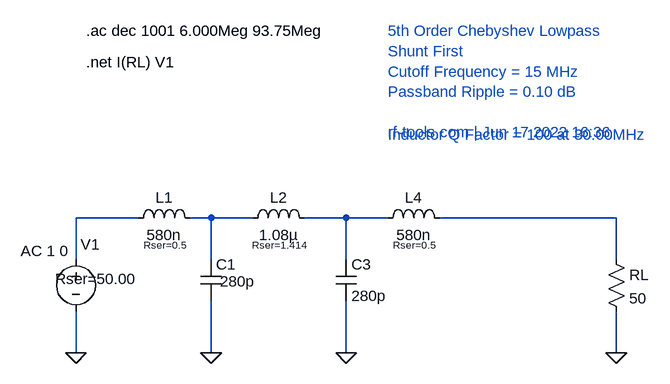
[diagram p0: schematic 14M.asc]
14M.asc, the LTspice schematic file:
Version 4
SHEET 1 1200 400
WIRE 96 0 0 0
WIRE 208 0 176 0
WIRE 272 0 208 0
WIRE 416 0 352 0
WIRE 480 0 416 0
WIRE 832 0 560 0
WIRE 0 64 0 0
WIRE 208 64 208 0
WIRE 416 64 416 0
WIRE 832 64 832 0
WIRE 0 208 0 144
WIRE 208 208 208 128
WIRE 416 208 416 128
WIRE 832 208 832 144
FLAG 0 208 0
FLAG 208 208 0
FLAG 416 208 0
FLAG 832 208 0
SYMBOL voltage 0 48 R0
WINDOW 123 -85 3 Left 2
WINDOW 39 -32 46 Left 2
WINDOW 0 7 -7 Left 2
SYMATTR Value2 AC 1 0
SYMATTR SpiceLine Rser=50.00
SYMATTR InstName V1
SYMATTR Value ""
SYMBOL cap 192 64 R0
WINDOW 3 30 34 Left 2
SYMATTR Value 280p
SYMATTR InstName C1
SYMBOL ind 256 16 R270
WINDOW 0 32 56 VTop 2
WINDOW 3 5 56 VBottom 2
WINDOW 39 -36 57 VTop 1
SYMATTR InstName L2
SYMATTR Value 1.08µ
SYMATTR SpiceLine Rser=1.414
SYMBOL cap 400 64 R0
SYMATTR InstName C3
SYMATTR Value 280p
SYMBOL ind 464 16 R270
WINDOW 0 32 56 VTop 2
WINDOW 3 5 56 VBottom 2
WINDOW 39 -36 57 VTop 1
SYMATTR InstName L4
SYMATTR Value 580n
SYMATTR SpiceLine Rser=0.5
SYMBOL res 816 48 R0
SYMATTR InstName RL
SYMATTR Value 50
SYMBOL ind 80 16 R270
WINDOW 0 32 56 VTop 2
WINDOW 3 5 56 VBottom 2
WINDOW 39 -36 57 VTop 1
SYMATTR InstName L1
SYMATTR Value 580n
SYMATTR SpiceLine Rser=0.5
TEXT 16 -288 Left 2 !.ac dec 1001 6.000Meg 93.75Meg
TEXT 16 -240 Left 2 !.net I(RL) V1
TEXT 480 -288 Left 2 ;5th Order Chebyshev Lowpass\nShunt First\nCutoff Frequency = 15 MHz\nPassband Ripple = 0.10 dB\n\nrf-tools.com | Jun 17 2022 16:36
TEXT 480 -128 Left 2 ;Inductor Q Factor = 100 at 30.00MHz

The netlist it stands for:
* 14M.asc
V1 N001 0 AC 1 0 Rser=50.00
C1 N002 0 280p
L2 N002 N003 1.08µ Rser=1.414
C3 N003 0 280p
L4 N003 N004 580n Rser=0.5
RL N004 0 50
L1 N001 N002 580n Rser=0.5
.ac dec 1001 6.000Meg 93.75Meg
.net I(RL) V1
* 5th Order Chebyshev Lowpass
* Shunt First
* Cutoff Frequency = 15 MHz
* Passband Ripple = 0.10 dB
* rf-tools.com | Jun 17 2022 16:36
* Inductor Q Factor = 100 at 30.00MHz
.backanno
.end